# EAGLE design mbedshield050 (EAGLE 6.4)
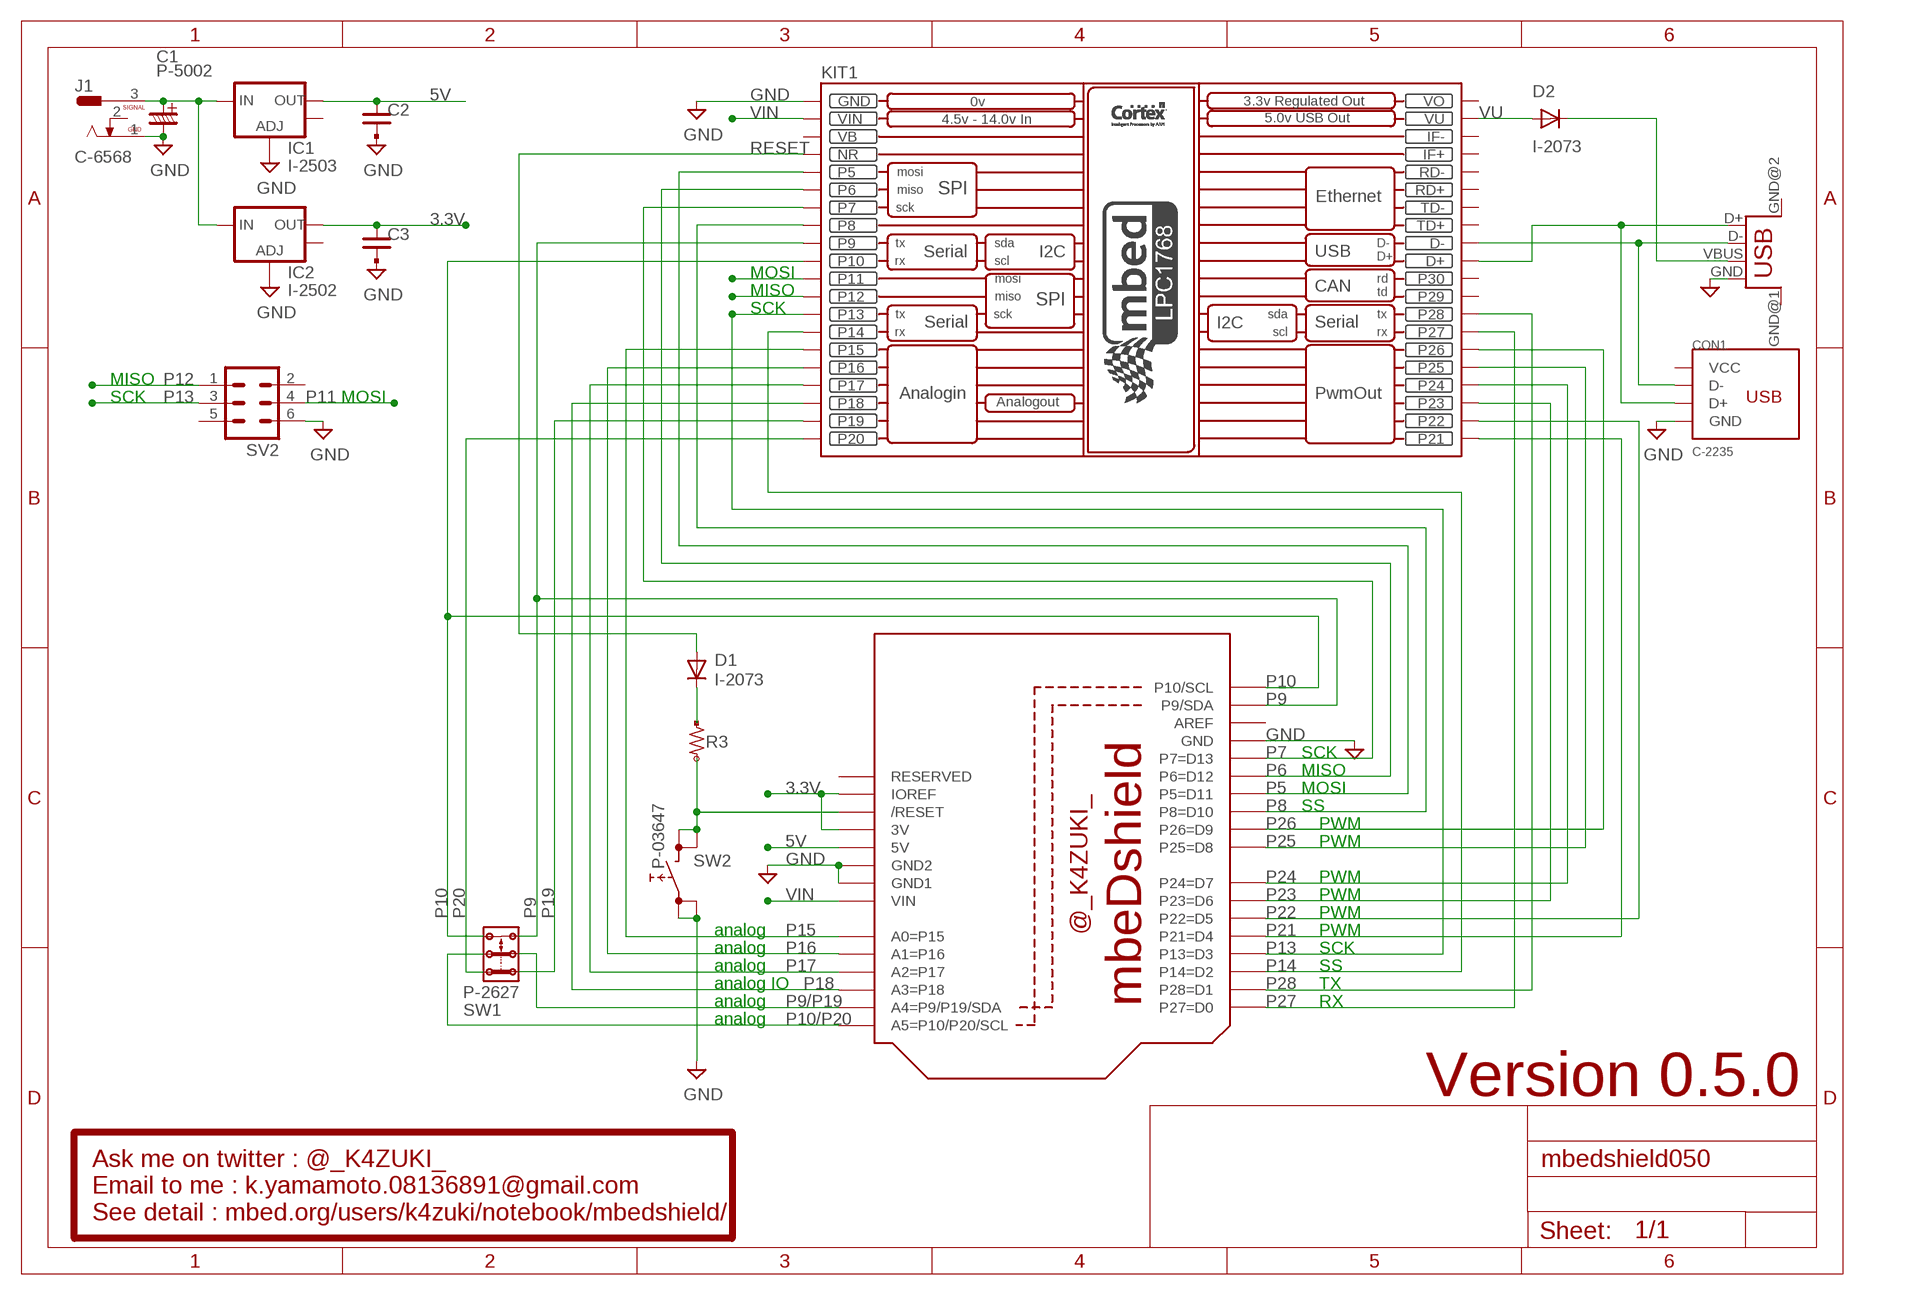
[diagram p0: schematic, sheet 1]

## Parts
C1  P-5002  C_DENKAI_2.5P6  [C_2.5PHI6]
C2  C_PAD_PAD_1608  [CR_1608]
C3  C_PAD_PAD_1608  [CR_1608]
CON1  C-2235  CON_USB  [CON_USB_MINIB_AKI]
D1  I-2073  PMLL4150  [SOD80C]
D2  I-2073  PMLL4150  [SOD80C]
IC1  I-2503  V_REG_LM1117SOT223  [SOT223]
IC2  I-2502  V_REG_LM1117SOT223  [SOT223]
J1  C-6568  CON_DCJACK1  [CON_DCJACK]
KIT1  MBED_NXP_LPC1768  [MBED-KIT]
R3  R_US_PAD_VIA_2125  [R_2125_PADVIA]
SV2  MA03-2  [MA03-2]
SW1  P-2627  SW_SLIDESW_2_  [SW_SLIDE_2X2_1]
SW2  P-03647  SW_TACTSW_S2  [SW_TACTSW_B3F-10XX]
U$1  BOARD_MBEDSHIELD2  [BOARD_MBEDSHIELD2]
USB  C-160  USB  [USB-FEMALE-A-PTH]

## Nets
3.3V: C3.P$1 IC2.2(OUT) U$1.3V U$1.IOREF
5V: C2.P$1 IC1.2(OUT) U$1.5V
GND [power]: C1.- C2.P$2 C3.P$2 CON1.GND IC1.1(ADJ) IC2.1(ADJ) J1.1 KIT1.GND SV2.6 SW2.1 SW2.2 U$1.GND U$1.GND1 U$1.GND2 USB.GND
N$27: D1.C R3.PAD
N$28: R3.VIA SW2.3 SW2.4 U$1.RESET(/RESET)
N$42: D2.C USB.VBUS
N$44: CON1.D- KIT1.D- USB.D-
N$45: CON1.D+ KIT1.D+ USB.D+
P5: KIT1.P$5(P5) U$1.D11(P5=D11)
P6: KIT1.P$6(P6) U$1.D12(P6=D12)
P7: KIT1.P$7(P7) U$1.D13(P7=D13)
P8: KIT1.P$8(P8) U$1.D10(P8=D10)
P9: KIT1.P$9(P9) SW1.2.1 U$1.SDA(P9/SDA)
P9/P19: SW1.COM.1 U$1.A4(A4=P9/P19/SDA)
P10: KIT1.P$10(P10) SW1.2.2 U$1.SCL(P10/SCL)
P10/P20: SW1.COM.2 U$1.A5(A5=P10/P20/SCL)
P11: KIT1.P$11(P11) SV2.4
P12: KIT1.P$12(P12) SV2.1
P13: KIT1.P$13(P13) SV2.3 U$1.D3(P13=D3)
P14: KIT1.P$14(P14) U$1.D2(P14=D2)
P15: KIT1.P$15(P15) U$1.A0(A0=P15)
P16: KIT1.P$16(P16) U$1.A1(A1=P16)
P17: KIT1.P$17(P17) U$1.A2(A2=P17)
P18: KIT1.P$18(P18) U$1.A3(A3=P18)
P19: KIT1.P$19(P19) SW1.1.1
P20: KIT1.P$20(P20) SW1.1.2
P21: KIT1.P$21(P21) U$1.D4(P21=D4)
P22: KIT1.P$22(P22) U$1.D5(P22=D5)
P23: KIT1.P$23(P23) U$1.D6(P23=D6)
P24: KIT1.P$24(P24) U$1.D7(P24=D7)
P25: KIT1.P$25(P25) U$1.D8(P25=D8)
P26: KIT1.P$26(P26) U$1.D9(P26=D9)
P27: KIT1.P$27(P27) U$1.D0(P27=D0)
P28: KIT1.P$28(P28) U$1.D1(P28=D1)
RESET: D1.A KIT1.NR
VIN [power]: C1.+ IC1.3(IN) IC2.3(IN) J1.3 KIT1.VIN U$1.VIN
VU: D2.A KIT1.VU
Unconnected: CON1.VBUS(VCC) IC1.4(OUT) IC2.4(OUT) J1.2 KIT1.IF+ KIT1.IF- KIT1.P$29(P29) KIT1.P$30(P30) KIT1.RD+ KIT1.RD- KIT1.TD+ KIT1.TD- SV2.2 SV2.5 U$1.AREF U$1.RESERVED USB.GND@1(GND) USB.GND@2(GND)

## Notes on the sheet
- MOSI
- MISO
- SCK
- MISO
- SCK | MOSI
- SCK
- MISO
- MOSI
- SS
- PWM
- PWM
- PWM
- PWM
- PWM
- analog | PWM
- analog | SCK
- analog | SS
- analog IO | TX
- analog | RX
- analog
- Version 0.5.0
- Ask me on twitter : @_K4ZUKI_
  Email to me : k.yamamoto.08136891@gmail.com
  See detail : mbed.org/users/k4zuki/notebook/mbedshield/

## Power pins joined to a net without a drawn wire
VB: KIT1.VB
VO: KIT1.VOUT(VO)

## Library data of the parts
C1 = mylib:C_DENKAI: (Device name) : (Main function of the device) Packages : (Variant name1) : (Pitch) x (Pin) x (Width) (Variant name2) : (Pitch) x (Pin) x (Width) (Variant name3) : (Pitch) x (Pin) x (Width) ...
C2 C3 = mylib:C_PAD_PAD_: SMD CAPACITOR : PAD - PAD
CON1 = mylib:CON_USB: USB B CONNECTOR
D1 D2 = diode:PMLL4150: DIODE high speed
IC1 IC2 = SparkFun:V_REG_LM1117: Voltage Regulator LM1117 Standard adjustable voltage regulator but in SMD form. Spark Fun Electronics SKU : COM-00595
J1 = mylib:CON_DCJACK: DC JACK : 2.1 / 2.5 mm
KIT1 = MBED_v2.1:MBED_NXP_LPC1768: Mbed LPC1768 - ARM CORTEX v2.1 * Schematic symbol is now placed in eagles's default raster. *The pads diameter are suitable for routing between mbed pins * mbed pads are 0.8 mm drill diameter. --------------------------------------------- Created by: Mohamed Yousry *Alexandria, Egypt *Email: mohamed.yousry@ieeegoldegypt.org
R3 = mylib:R_US_PAD_VIA: R_US_PAD_PAD : SMD R PAD is TH-NTH Packages : _1608 : 1.6 x 0.8 mm _2125 : 2.0 x 1.25 mm _3216 : 3.2 x 1.6 mm
SV2 = con-lstb:MA03-2: PIN HEADER; OC_FARNELL: unknown; OC_NEWARK: unknown
SW1 = mylib:SW_SLIDESW_2_
SW2 = mylib:SW_TACTSW_
U$1 = mylib:BOARD_MBEDSHIELD2
USB = STUNTAZ:USB: USB Connectors USB-FEMALE-A-PTH: Through hole Female Type A Connector

## Net classes
0 signal: width 0.406 mm, drill 0.381 mm
1 power: width 0.254 mm, drill 0.381 mm

## Board
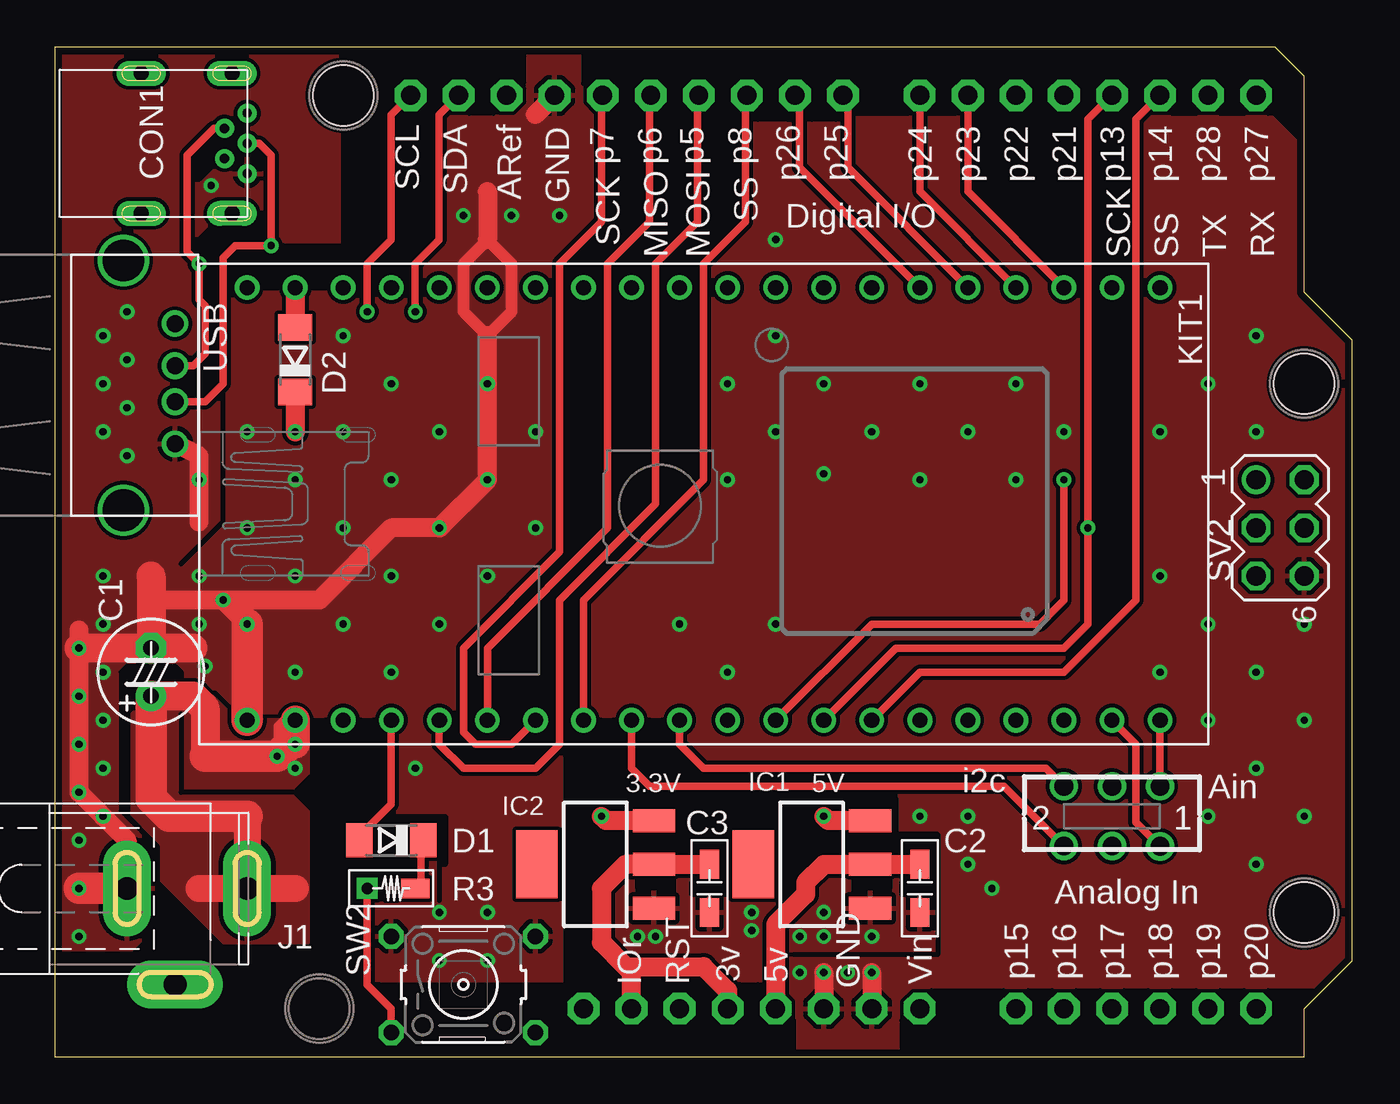
[diagram p1: board, top side]
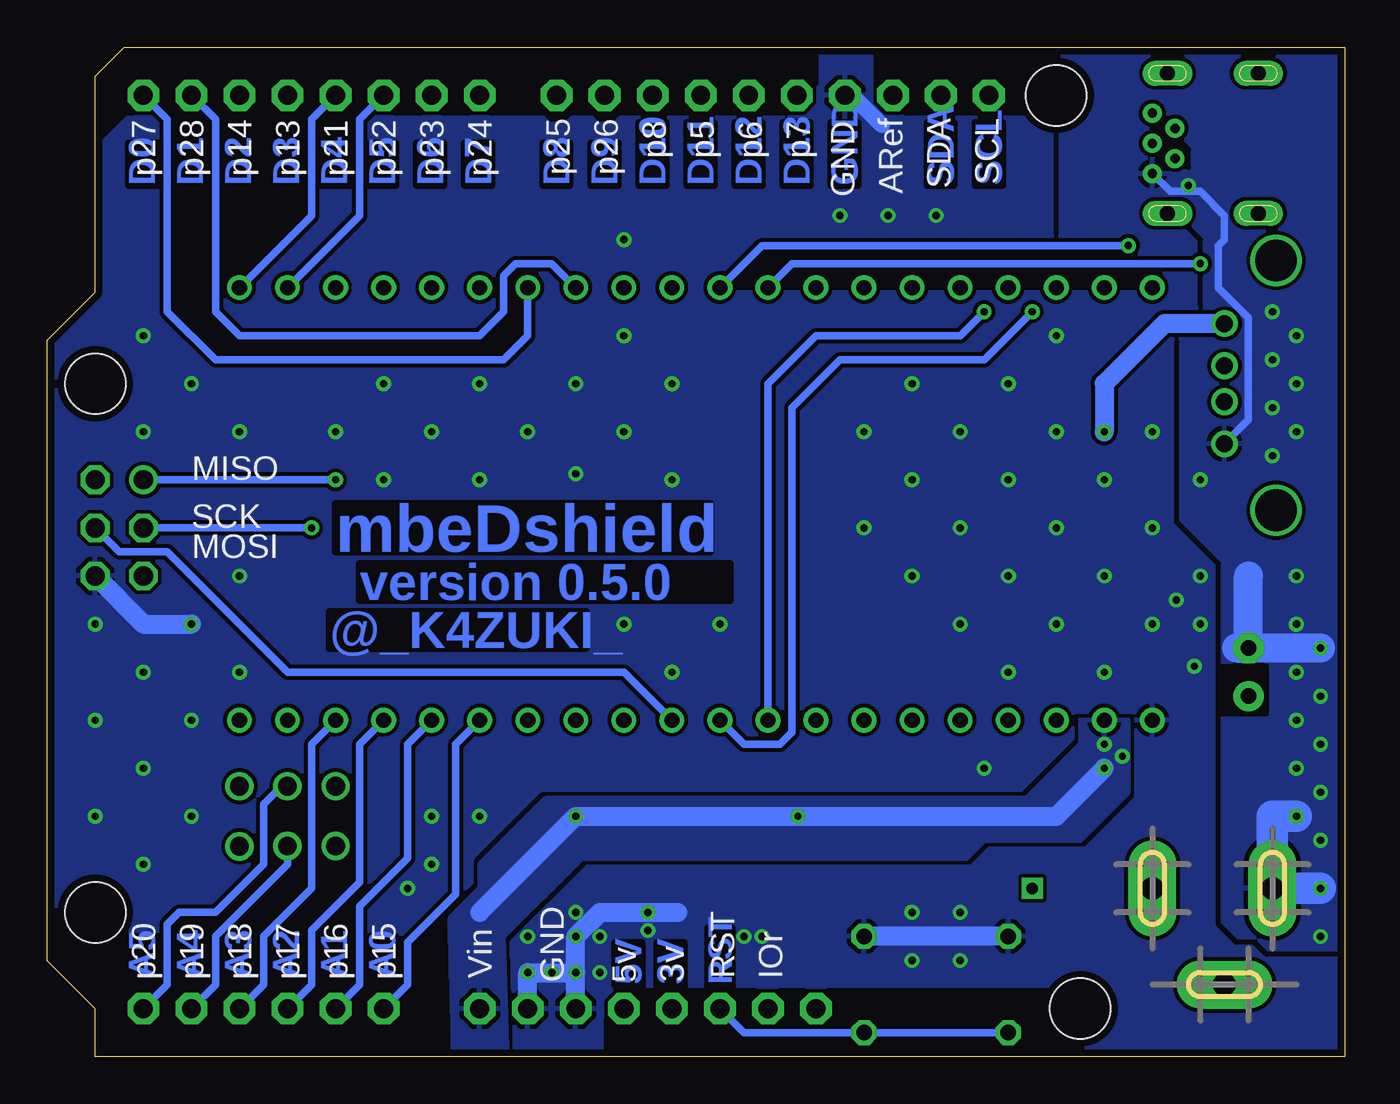
[diagram p2: board, bottom side, seen from below]

Size 68.58 x 53.34 mm. Coordinates in mm from the lower left corner, seen from the top.
Copper layers (1*16): Top 0.0356mm / dielectric 1.5011mm / Bottom 0.0356mm
Design rules "SilverCircuits *": minimum track width 10mil, minimum drill 15mil, track to track 8mil, track to pad 8mil, pad to pad 8mil, via to via 8mil, smd to smd 8mil, copper to edge 15mil, drill to drill 8mil, minimum pad ring 10mil, minimum via ring 8mil, stop-mask expansion 4mil, vias tented up to drill 100mil, thermal gap 10mil
Holes 3.2 mm at 66.04,35.56 66.04,7.62 13.97,2.54 15.24,50.8
tRestrict: area 33.7,8.6 to 35.6,9.2; area 44.8,8.6 to 46.7,9.2; area 30.8,8.9 to 32.7,9.2; area 42.2,8.9 to 44.1,9.2; 74 lines
bRestrict: 57 lines
Milling: 12 lines

### Footprints (pad centres in the part's own frame; a part is rotated, then mirrored left to right if it is on the bottom)
C_2.5PHI6 = drill 0.813 pad 1.6: + -1.27,0 | drill 0.813 pad 1.6 octagon: - 1.27,0
CR_1608 = smd 1.524 x 1.016: P$1 -1.27,0; P$2 1.27,0
CON_USB_MINIB_AKI = drill 0.5: D+ 0,0; D- -1.2,0.8; GND 0,-1.6; ID -1.2,-0.8; VBUS 0,1.6 | drill 0.8 long: G -5.6,-3.7; G@1 -5.6,3.7; G@2 -0.8,3.7; G@3 -0.8,-3.7
SOD80C = smd 1.4 x 1.8: A 1.7,0; C -1.7,0
SOT223 = smd 1.219 x 2.235: 1 -2.311,-3.099; 2 0,-3.099; 3 2.311,-3.099 | smd 3.6 x 2.2: 4 0,3.099
CON_DCJACK = drill 1.2 pad 2.54 long: 1 -0.635,0; 2 1.905,-5.08; 3 5.715,0
MBED-KIT = drill 0.8: D+ 11.43,1.27; D- 11.43,3.81; GND -11.43,24.13; IF+ 11.43,16.51; IF- 11.43,19.05; NR -11.43,16.51; P$5 -11.43,13.97; P$6 -11.43,11.43; P$7 -11.43,8.89; P$8 -11.43,6.35; P$9 -11.43,3.81; P$10 -11.43,1.27; P$11 -11.43,-1.27; P$12 -11.43,-3.81; P$13 -11.43,-6.35; P$14 -11.43,-8.89; P$15 -11.43,-11.43; P$16 -11.43,-13.97; P$17 -11.43,-16.51; P$18 -11.43,-19.05; P$19 -11.43,-21.59; P$20 -11.43,-24.13; P$21 11.43,-24.13; P$22 11.43,-21.59; P$23 11.43,-19.05; P$24 11.43,-16.51; P$25 11.43,-13.97; P$26 11.43,-11.43; P$27 11.43,-8.89; P$28 11.43,-6.35; P$29 11.43,-3.81; P$30 11.43,-1.27; RD+ 11.43,11.43; RD- 11.43,13.97; TD+ 11.43,6.35; TD- 11.43,8.89; VB -11.43,19.05; VIN -11.43,21.59; VOUT 11.43,24.13; VU 11.43,21.59
R_2125_PADVIA = smd 1.524 x 1.016: PAD 1.27,0 | drill 0.61 square: VIA -1.27,0
MA03-2 = drill 1.016: 1 -2.54,-1.27 | drill 1.016 octagon: 2 -2.54,1.27; 3 0,-1.27; 4 0,1.27; 5 2.54,-1.27; 6 2.54,1.27
SW_SLIDE_2X2_1 = drill 0.991: 1.1 -2.54,1.587; 1.2 -2.54,-1.587; 2.1 2.54,1.575; 2.2 2.54,-1.587; COM.1 0,1.575; COM.2 0,-1.587
SW_TACTSW_B3F-10XX = drill 0.813 octagon: 1 -3.81,2.54; 2 3.81,2.54; 3 -3.81,-2.54; 4 3.81,-2.54
BOARD_MBEDSHIELD2 = drill 1 pad 1.676 octagon: 3V 35.56,2.54; 5V 38.1,2.54; A0 50.8,2.54; A1 53.34,2.54; A2 55.88,2.54; A3 58.42,2.54; A4 60.96,2.54; A5 63.5,2.54; AREF 23.876,50.8; D0 63.5,50.8; D1 60.96,50.8; D2 58.42,50.8; D3 55.88,50.8; D4 53.34,50.8; D5 50.8,50.8; D6 48.26,50.8; D7 45.72,50.8; D8 41.656,50.8; D9 39.116,50.8; D10 36.576,50.8; D11 34.036,50.8; D12 31.496,50.8; D13 28.956,50.8; GND 26.416,50.8; GND1 43.18,2.54; GND2 40.64,2.54; IOREF 30.48,2.54; RESERVED 27.94,2.54; RESET 33.02,2.54; SCL 18.796,50.8; SDA 21.336,50.8; VIN 45.72,2.54
USB-FEMALE-A-PTH = drill 0.9: D+ -0.953,0; D- 0.953,0; GND -3.175,0; VBUS 3.175,0 | drill 2.2: GND@1 6.515,2.73; GND@2 -6.685,2.73

### Placement (x,y rotation side)
C1  5.08,20.32 90 top
C2  45.72,8.89 270 top
C3  34.61,8.89 270 top
CON1  10.16,48.26 0 top
D1  17.78,11.43 180 top
D2  12.7,36.83 90 top
IC1  40.01,10.16 90 top
IC2  28.57,10.16 90 top
J1  4.45,8.89 0 top
KIT1  34.29,29.21 90 top
R3  17.78,8.89 0 top
SV2  64.77,27.94 270 top
SW1  55.88,12.7 180 top
SW2  21.59,3.81 0 top
U$1  0,0 0 top
USB  6.35,35.56 90 top

### Tracks (layer width: path | path; a pad name or v marks a point on that pad's centre or on a via)
3.3V
  Top 1.016: 30.16,4.76 28.89,6.03 28.89,8.89 30.16,10.16 IC2.2 C3.P$1 | 30.16,4.76 34.29,4.76 35.56,3.49 U$1.3V | U$1.IOREF 30.48,4.45 30.16,4.76
5V
  Top 1.016: U$1.5V 38.1,6.99 39.69,8.57 39.69,9.21 40.64,10.16 IC1.2 C2.P$1
GND  (via drill 0.38)
  Top 0.61: 22.86,43.18 21.59,41.91 21.59,39.37 22.86,38.1 24.13,39.37 24.13,41.91 22.86,43.18
  Top 1.016: 1.27,22.54 v1.27,21.59 v1.27,13.97 v2.54,12.7 3.81,11.43 J1.1 | 25.4,49.78 U$1.GND | 22.86,38.1 v22.86,30.48 v20.32,27.94 17.78,27.94 13.97,24.13 v8.89,24.13 | 22.86,45.72 22.86,43.18 | v8.89,24.13 v10.16,22.86 | 7.62,28.26 7.62,31.75 USB.GND | v40.64,4.45 U$1.GND2 | v43.18,4.45 U$1.GND1 | v8.89,24.13 5.42,24.13
  Top 1.524: 7.3,21.59 C1.- | C1.- v1.27,21.59 | 5.08,25.4 C1.-
  Top 1.676: v10.16,22.86 KIT1.GND | J1.1 v1.27,8.89
  Bottom 0.406: CON1.GND 10.15,46.66 9.21,45.72 7.62,45.72 6.35,44.45 6.35,43.18 6.67,42.86 6.67,40.64 5.08,39.05 5.08,33.66 USB.GND
  Bottom 0.813: 26.04,50.8 24.45,49.21
  Bottom 1.016: U$1.GND2 v40.64,4.45 | v40.64,4.45 v40.64,6.35 39.37,7.62 35.24,7.62 | SV2.6 63.5,22.86 v60.96,22.86 | SW2.1 SW2.2 | U$1.GND1 v43.18,4.45 v40.64,4.45 | 26.35,50.8 26.04,50.8
  Bottom 1.524: 5.71,21.59 C1.- | v1.27,21.59 C1.- | C1.- 5.08,25.4
  Bottom 1.676: v1.27,8.89 J1.1 3.81,12.7 v2.54,12.7
  other vias: 38.1,33.02 40.64,35.56 43.18,33.02 45.72,35.56 22.86,25.4 25.4,27.94 20.32,33.02 22.86,35.56 25.4,33.02 17.78,35.56 15.24,38.1 38.1,43.18 38.1,38.1 15.24,33.02 12.7,30.48 15.24,27.94 10.16,27.94 10.16,33.02 7.62,30.48 2.54,33.02 7.62,25.4 12.7,25.4 15.24,22.86 17.78,20.32 12.7,20.32 7.94,20.64 31.75,6.35 39.37,6.35 43.18,6.35 2.54,35.56 2.54,38.1 1.27,16.51 8.26,46.04 40.64,7.62 41.91,4.45 39.37,4.45 63.5,20.32 63.5,33.02 60.96,35.56 63.5,38.1 26.67,44.45 24.13,44.45 21.59,44.45 48.26,33.02 50.8,35.56 53.34,33.02 22.86,5.08 22.86,7.62 20.32,5.08 19.05,15.24 2.54,20.32 2.54,17.78 1.27,19.05 2.54,15.24 1.27,11.43 1.27,6.35 7.62,22.86 2.54,25.4 3.81,31.75 3.81,34.29 3.81,36.83 3.81,39.37 48.26,10.16 48.26,12.7 45.72,12.7 17.78,30.48 17.78,25.4 20.32,22.86 35.56,35.56 45.72,30.48 40.64,30.8 35.56,30.48 38.1,22.86 35.56,20.32 33.02,22.86 58.42,33.02 58.42,20.32 58.42,25.4 60.96,17.78 66.04,17.78 63.5,15.24 66.04,12.7 63.5,10.16 60.96,12.7 66.04,22.86 2.54,22.86 50.8,30.48 49.53,8.89 36.83,6.67 36.83,7.62 30.8,6.35 20.32,7.62
  pour Top (rank 3): -0.32,53.98 68.9,53.98 68.9,-0.64 -0.32,-0.64
  pour Bottom (rank 6): -0.64,53.66 69.22,53.66 69.22,-0.32 -0.64,-0.32
N$27
  Top 0.406: D1.C 19.37,11.43 19.37,8.89 R3.PAD
N$28
  Top 0.406: R3.VIA 16.51,3.81 17.78,2.54 SW2.3
  Bottom 0.406: U$1.RESET 31.75,1.27 SW2.4 SW2.3
N$42  (via drill 0.38)
  Top 1.016: D2.C v12.7,33.02
  Bottom 1.016: USB.VBUS 9.53,38.73 12.7,35.56 v12.7,33.02
N$44  (via drill 0.38)
  Top 0.406: USB.D- 7.3,36.51 7.94,37.15 7.94,39.69 7.62,40.01 v7.62,41.91 6.99,42.55 6.99,47.62 8.42,49.06 CON1.D-
  Bottom 0.406: KIT1.D- 29.21,41.91 v7.62,41.91
N$45  (via drill 0.38)
  Top 0.406: USB.D+ 7.94,34.61 8.89,35.56 8.89,42.23 9.53,42.86 v11.43,42.86 11.43,47.62 10.79,48.26 CON1.D+
  Bottom 0.406: KIT1.D+ 30.8,42.86 v11.43,42.86
P5
  Top 0.406: KIT1.P$5 20.32,16.51 21.59,15.24 25.4,15.24 26.67,16.51 26.67,24.13 31.75,29.21 31.75,41.91 33.97,44.13 33.97,50.8 U$1.D11
P6
  Top 0.406: KIT1.P$6 22.86,21.59 29.21,27.94 29.21,41.91 31.43,44.13 31.43,50.8 U$1.D12
P7
  Top 0.406: KIT1.P$7 24.13,16.51 22.23,16.51 21.59,17.14 21.59,21.59 26.67,26.67 26.67,41.91 28.89,44.13 28.89,50.8 U$1.D13
P8
  Top 0.406: KIT1.P$8 27.94,24.13 34.29,30.48 34.29,41.91 36.51,44.13 36.51,50.8 U$1.D10
P9  (via drill 0.38)
  Top 0.406: KIT1.P$9 30.48,15.24 31.43,14.29 50.18,14.29 SW1.2.1 | U$1.SDA 20.32,49.78 20.32,43.18 19.05,41.91 v19.05,39.37
  Bottom 0.406: v19.05,39.37 20.32,38.1 27.94,38.1 30.48,35.56 KIT1.P$9
P9/P19
  Bottom 0.406: SW1.COM.1 55.88,10.16 59.69,6.35 59.69,3.81 U$1.A4
P10  (via drill 0.38)
  Top 0.406: SW1.2.2 52.39,15.24 34.29,15.24 33.02,16.51 KIT1.P$10 | U$1.SCL 17.78,49.78 17.78,43.18 16.51,41.91 v16.51,39.37
  Bottom 0.406: v16.51,39.37 19.05,36.83 26.67,36.83 29.21,34.29 29.21,17.14 29.84,16.51 31.75,16.51 KIT1.P$10
P10/P20
  Bottom 0.406: SW1.COM.2 56.2,14.29 57.15,13.34 57.15,10.16 59.69,7.62 61.59,7.62 62.23,6.99 62.23,3.81 U$1.A5
P11
  Bottom 0.406: KIT1.P$11 38.1,20.32 55.88,20.32 62.23,26.67 64.77,26.67 SV2.4
P12  (via drill 0.38)
  Top 0.406: KIT1.P$12 43.18,22.86 52.07,22.86 53.34,24.13 v53.34,30.48
  Bottom 0.406: v53.34,30.48 SV2.1
P13  (via drill 0.38)
  Top 0.406: KIT1.P$13 44.45,21.59 53.34,21.59 54.61,22.86 v54.61,27.94 54.61,49.53 U$1.D3
  Bottom 0.406: SV2.3 v54.61,27.94
P14
  Top 0.406: KIT1.P$14 45.72,20.32 53.34,20.32 57.15,24.13 57.15,49.53 U$1.D2
P15
  Bottom 0.406: KIT1.P$15 46.99,16.51 46.99,8.57 49.53,6.03 49.53,3.81 U$1.A0
P16
  Bottom 0.406: KIT1.P$16 49.53,16.51 49.53,10.48 52.07,7.94 52.07,3.81 U$1.A1
P17
  Bottom 0.406: KIT1.P$17 52.07,16.51 52.07,9.21 54.61,6.67 54.61,3.81 U$1.A2
P18
  Bottom 0.406: KIT1.P$18 54.61,16.51 54.61,8.89 57.15,6.35 57.15,3.81 U$1.A3
P19
  Top 0.406: KIT1.P$19 57.15,16.51 57.15,12.38 SW1.1.1
P20
  Top 0.406: KIT1.P$20 SW1.1.2
P21
  Bottom 0.406: U$1.D4 54.61,49.53 54.61,44.45 KIT1.P$21
P22
  Bottom 0.406: U$1.D5 52.07,49.53 52.07,44.45 KIT1.P$22
P23
  Top 0.406: U$1.D6 48.26,45.72 KIT1.P$23
P24
  Top 0.406: U$1.D7 45.72,45.72 KIT1.P$24
P25
  Top 0.406: U$1.D8 41.91,50.55 41.91,46.99 KIT1.P$25
P26
  Top 0.406: U$1.D9 39.37,50.55 39.37,46.99 KIT1.P$26
P27
  Bottom 0.406: KIT1.P$27 43.18,38.1 44.45,36.83 59.69,36.83 62.23,39.37 62.23,49.53 U$1.D0
P28
  Bottom 0.406: KIT1.P$28 41.91,41.91 43.81,41.91 44.45,41.27 44.45,39.37 45.72,38.1 58.42,38.1 59.69,39.37 59.69,49.53 U$1.D1
RESET
  Top 0.406: KIT1.NR 17.78,13.34 16.08,11.63 D1.A
VIN  (via drill 0.38)
  Top 0.406: v11.75,15.88 11.75,17.46 12.06,17.78 KIT1.VIN
  Top 1.016: IC1.3 40.87,12.47 v40.64,12.7 | IC2.3 29.12,12.47 v28.89,12.7
  Top 1.422: 7.62,8.89 J1.3 | J1.3 12.7,8.89 | 10.16,12.7 J1.3
  Top 1.524: 7.94,15.88 7.94,18.41 7.3,19.05 C1.+ | KIT1.VIN v12.7,16.51 12.38,16.51
  Top 1.676: 7.94,15.88 v11.75,15.88 12.38,16.51 | 10.16,12.7 6.03,12.7 5.08,13.65 C1.+
  Bottom 1.016: 45.72,7.62 v40.64,12.7 v28.89,12.7 15.24,12.7 v12.7,15.24
  pour Top (rank 2): 4.13,18.1 5.08,19.05 8.26,19.05 9.53,17.78 13.34,17.78 13.34,6.03 4.13,6.03
  pour Bottom: 11.43,17.78 13.97,17.78 13.97,16.51 16.83,13.65 42.23,13.65 45.72,10.16 45.72,8.89 47.31,7.3 46.99,-3.81 44.13,-3.81 44.45,6.35 40.32,10.48 20,10.48 19.05,11.43 13.97,11.43 11.43,13.97
VU
  Top 1.016: KIT1.VU D2.A

### Text on the board
Bottom: SCL | SDA | GND | D13 | D12 | D11 | D10 | D9 | D8 | D7 | D6 | D5 | D4 | D3 | D2 | D1 | D0 | mbeDshield | version 0.5.0 | @_K4ZUKI_ | RST | 3V | 5V | A0 | A1 | A2 | A3 | A4 | A5
tPlace: SS | SCK | MISO | MOSI | SCK | SS | TX | RX | 3.3V | 5V | i2c | Ain
bPlace: MISO | SCK | MOSI